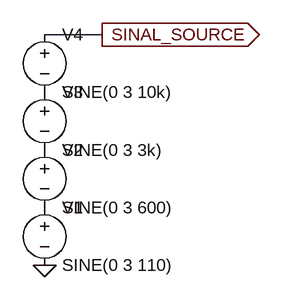
[diagram p0: schematic Source.asc]
Source.asc, the LTspice schematic file:
Version 4
SHEET 1 880 680
WIRE 32 80 -48 80
FLAG -48 400 0
FLAG 32 80 SINAL_SOURCE
IOPIN 32 80 Out
SYMBOL voltage -48 304 R0
WINDOW 123 0 0 Left 2
WINDOW 39 0 0 Left 2
SYMATTR InstName V1
SYMATTR Value SINE(0 3 110)
SYMBOL voltage -48 224 R0
WINDOW 123 0 0 Left 2
WINDOW 39 0 0 Left 2
SYMATTR InstName V2
SYMATTR Value SINE(0 3 600)
SYMBOL voltage -48 144 R0
WINDOW 123 0 0 Left 2
WINDOW 39 0 0 Left 2
SYMATTR InstName V3
SYMATTR Value SINE(0 3 3k)
SYMBOL voltage -48 64 R0
WINDOW 123 0 0 Left 2
WINDOW 39 0 0 Left 2
SYMATTR InstName V4
SYMATTR Value SINE(0 3 10k)

The netlist it stands for:
* Source.asc
V1 P001 0 SINE(0 3 110)
V2 P002 P001 SINE(0 3 600)
V3 P003 P002 SINE(0 3 3k)
V4 SINAL_SOURCE P003 SINE(0 3 10k)
.backanno
.end